# Altium project NOS_EEG_V2.PrjPcb
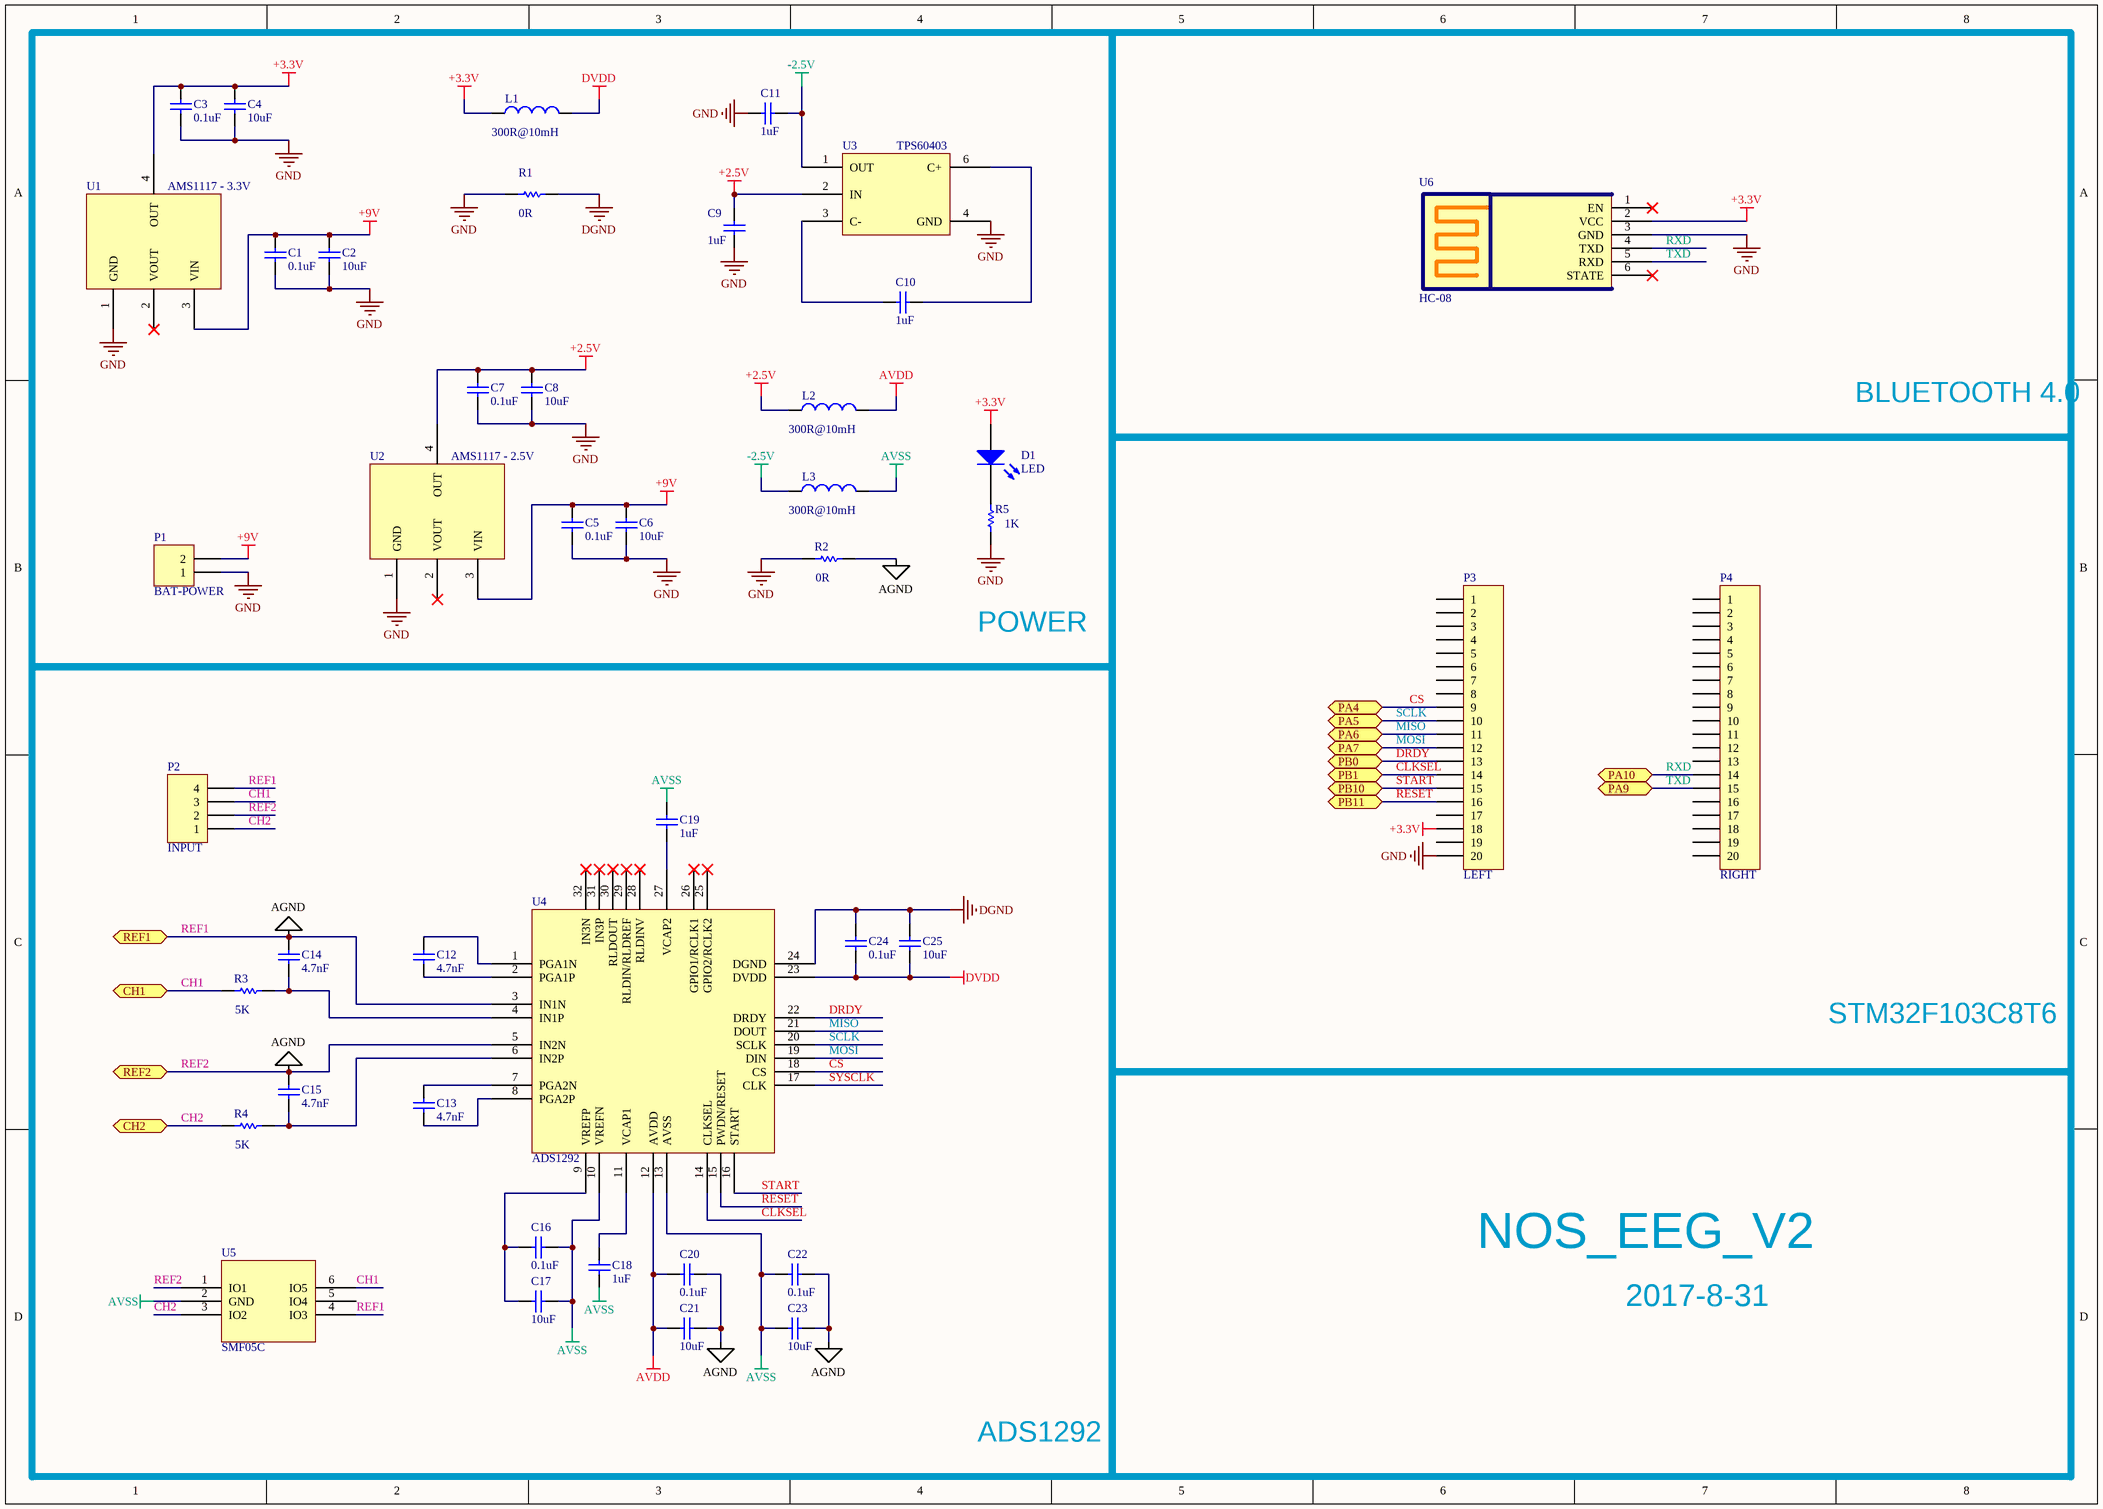
[diagram p0: NOS_EEG_V2.SchDoc]
1 sheet, 44 parts. Net scope: flat (ports and power ports of the same name join across sheets).
Board file: NOS_EEG_V2.PcbDoc

## Sheet NOS_EEG_V2.SchDoc
size A3; PageSetup: Record=PageOptions|CenterHorizontal=True|CenterVertical=True|PrintScale=0.73|XCorrection=1.00|YCorrection=1.00|PrintKind=0|BorderSize=5000000|LeftOffset=0|BottomOffset=0|Orientation=2|PaperLength=1000|PaperWidth=1000|Scale=100|PaperSource=7|PrintQuality=-4|MediaType=1|DitherType=10|PaperKind=A4|PrintScaleMode=1

### Parts
C1  value 0.1uF  [0603]  (hidden comment: Cap)
C2  value 10uF  [0603]  (hidden comment: Cap)
C3  value 0.1uF  [0603]  (hidden comment: Cap)
C4  value 10uF  [0603]  (hidden comment: Cap)
C5  value 0.1uF  [0603]  (hidden comment: Cap)
C6  value 10uF  [0603]  (hidden comment: Cap)
C7  value 0.1uF  [0603]  (hidden comment: Cap)
C8  value 10uF  [0603]  (hidden comment: Cap)
C9  value 1uF  [0603]  (hidden comment: Cap)
C10  value 1uF  [0603]  (hidden comment: Cap)
C11  value 1uF  [0603]  (hidden comment: Cap)
C12  value 4.7nF  [0603]  (hidden comment: Cap)
C13  value 4.7nF  [0603]  (hidden comment: Cap)
C14  value 4.7nF  [0603]  (hidden comment: Cap)
C15  value 4.7nF  [0603]  (hidden comment: Cap)
C16  value 0.1uF  [0603]  (hidden comment: Cap)
C17  value 10uF  [0603]  (hidden comment: Cap)
C18  value 1uF  [0603]  (hidden comment: Cap)
C19  value 1uF  [0603]  (hidden comment: Cap)
C20  value 0.1uF  [0603]  (hidden comment: Cap)
C21  value 10uF  [0603]  (hidden comment: Cap)
C22  value 0.1uF  [0603]  (hidden comment: Cap)
C23  value 10uF  [0603]  (hidden comment: Cap)
C24  value 0.1uF  [0603]  (hidden comment: Cap)
C25  value 10uF  [0603]  (hidden comment: Cap)
D1  LED  [0805]
L1  value 300R@10mH  [AXIAL0.4]  (hidden comment: Inductor)
L2  value 300R@10mH  [AXIAL0.4]  (hidden comment: Inductor)
L3  value 300R@10mH  [AXIAL0.4]  (hidden comment: Inductor)
P1  BAT-POWER  [HDR1X2]
P2  INPUT  [HDR1X4]
P3  LEFT  [HDR1X20]
P4  RIGHT  [HDR1X20]
R1  value 0R  [AXIAL-0.3]  (hidden comment: Res1)
R2  value 0R  [AXIAL-0.3]  (hidden comment: Res1)
R3  value 5K  [0603]  (hidden comment: Res1)
R4  value 5K  [0603]  (hidden comment: Res1)
R5  value 1K  [0603]  (hidden comment: Res1)
U1  AMS1117 - 3.3V  [SOT223]
U2  AMS1117 - 2.5V  [SOT223]
U3  TPS60403  [SOT23-5]
U4  ADS1292  [PBS32_M]
U5  SMF05C  [INF-SOT363_V]
U6  HC-08  [SIP6]

### Blocks framed on the sheet
POWER: C1-C11 D1 L1-L3 P1 R1 R2 R5 U1-U3
BLUETOOTH 4.0: U6
STM32F103C8T6: P3 P4
ADS1292: C12-C25 P2 R3 R4 U4 U5

### Ports
CH1, CH2, PA4, PA5, PA6, PA7, PA9, PA10, PB0, PB1, PB10, PB11, REF1, REF2

### Nets
+2.5V: C7.1 C8.1 C9.2 L2.1 U2.4(OUT) U3.2(IN)
+3.3V: C3.1 C4.1 D1.1(A) L1.1 P3.18 U1.4(OUT) U6.2(VCC)
+9V: C1.2 C2.2 C5.2 C6.2 P1.2 U1.3(VIN) U2.3(VIN)
-2.5V: C11.1 L3.1 U3.1(OUT)
AVDD: C20.2 C21.2 L2.2 U4.12(AVDD)
AVSS: C16.1 C17.1 C18.2 C19.1 C22.2 C23.2 L3.2 U4.10(VREFN) U4.13(AVSS) U5.2(GND)
DGND: C24.1 C25.1 R1.2 U4.24(DGND)
DVDD: C24.2 C25.2 L1.2 U4.23(DVDD)
GND: C1.1 C2.1 C3.2 C4.2 C5.1 C6.1 C7.2 C8.2 C9.1 C11.2 P1.1 P3.20 R1.1 R2.1 R5.1 U1.1(GND) U2.1(GND) U3.4(GND) U6.3(GND)
REF1: C14.2 C15.2 C20.1 C21.1 C22.1 C23.1 P2.2 P2.4 R2.2 U4.3(IN1N) U4.5(IN2N) U5.1(IO1) U5.4(IO3) ; port REF1, port REF2  [also labelled AGND, REF2]
CH1: P2.3 R3.1 U5.6(IO5) ; port CH1
CH2: P2.1 R4.1 U5.3(IO2) ; port CH2
CLKSEL: P3.14 U4.14(CLKSEL) ; port PB1
CS: P3.9 U4.18(CS) ; port PA4
DRDY: P3.13 U4.22(DRDY) ; port PB0
MISO: P3.11 U4.21(DOUT) ; port PA6
MOSI: P3.12 U4.19(DIN) ; port PA7
RESET: P3.16 U4.15(PWDN/RESET) ; port PB11
RXD: P4.14 U6.4(TXD) ; port PA10
SCLK: P3.10 U4.20(SCLK) ; port PA5
START: P3.15 U4.16(START) ; port PB10
SYSCLK: U4.17(CLK)
TXD: P4.15 U6.5(RXD) ; port PA9
NetC10_1: C10.1 U3.6(C+)
NetC10_2: C10.2 U3.3(C-)
NetC12_1: C12.1 U4.2(PGA1P)
NetC12_2: C12.2 U4.1(PGA1N)
NetC13_1: C13.1 U4.7(PGA2N)
NetC13_2: C13.2 U4.8(PGA2P)
NetC14_1: C14.1 R3.2 U4.4(IN1P)
NetC15_1: C15.1 R4.2 U4.6(IN2P)
NetC16_2: C16.2 C17.2 U4.9(VREFP)
NetC18_1: C18.1 U4.11(VCAP1)
NetC19_2: C19.2 U4.27(VCAP2)
NetD1_2: D1.2(K) R5.2

Not connected (* = marked no-connect by the designer): P3 1 2 3 4 5 6 7 8 17 19; P4 1 2 3 4 5 6 7 8 9 10 11 12 13 16 17 18 19 20; U1 2(VOUT)*; U2 2(VOUT)*; U4 25(GPIO2/RCLK2)* 26(GPIO1/RCLK1)* 28(RLDINV)* 29(RLDIN/RLDREF)* 30(RLDOUT)* 31(IN3P)* 32(IN3N)*; U5 5(IO4); U6 1(EN)* 6(STATE)*

### Notes on the sheet
- NOS_EEG_V2
- 2017-8-31

### Library data of the parts
C1-C25 = Cap: Capacitor; Published: 8-Jun-2000; LatestRevisionDate: 17-Jul-2002; LatestRevisionNote: Re-released for DXP Platform.; PackageReference: RAD-0.3; Publisher: Altium Limited
D1 = LED3: Typical BLUE SiC LED; Published: 8-Jun-2000; LatestRevisionDate: 17-Dec-2003; LatestRevisionNote: PCB Footprint replaced.; DatasheetDocument: 16-Apr-2002; PackageDocument: 16-Apr-2002; PackageReference: 3.5X2.8X1.9; Publisher: Altium Limited
L1-L3 = Inductor: Code_IEC: 1005; Published: 8-Jun-2000; LatestRevisionDate: 17-Jul-2002; LatestRevisionNote: Re-released for DXP Platform.; PackageReference: 0402-A; Publisher: Altium Limited; Code_JEITA: 0402
P1 = Header 2: Header, 2-Pin; LatestRevisionDate: 17-Jul-2002; LatestRevisionNote: Re-released for DXP Platform.; Publisher: Altium Limited
P2 = Header 4: Header, 4-Pin; LatestRevisionDate: 17-Jul-2002; LatestRevisionNote: Re-released for DXP Platform.; Publisher: Altium Limited
P3 P4 = Header 20: Header, 20-Pin; LatestRevisionDate: 17-Jul-2002; LatestRevisionNote: Re-released for DXP Platform.; Publisher: Altium Limited
R1-R5 = Res1: Resistor; Published: 8-Jun-2000; LatestRevisionDate: 17-Jul-2002; LatestRevisionNote: Re-released for DXP Platform.; PackageReference: AXIAL-0.3; Publisher: Altium Limited
U1 U2 = AMS1117
U6 = HC-05: bluetooth